# EAGLE design PortableShower (EAGLE 9.4.2)
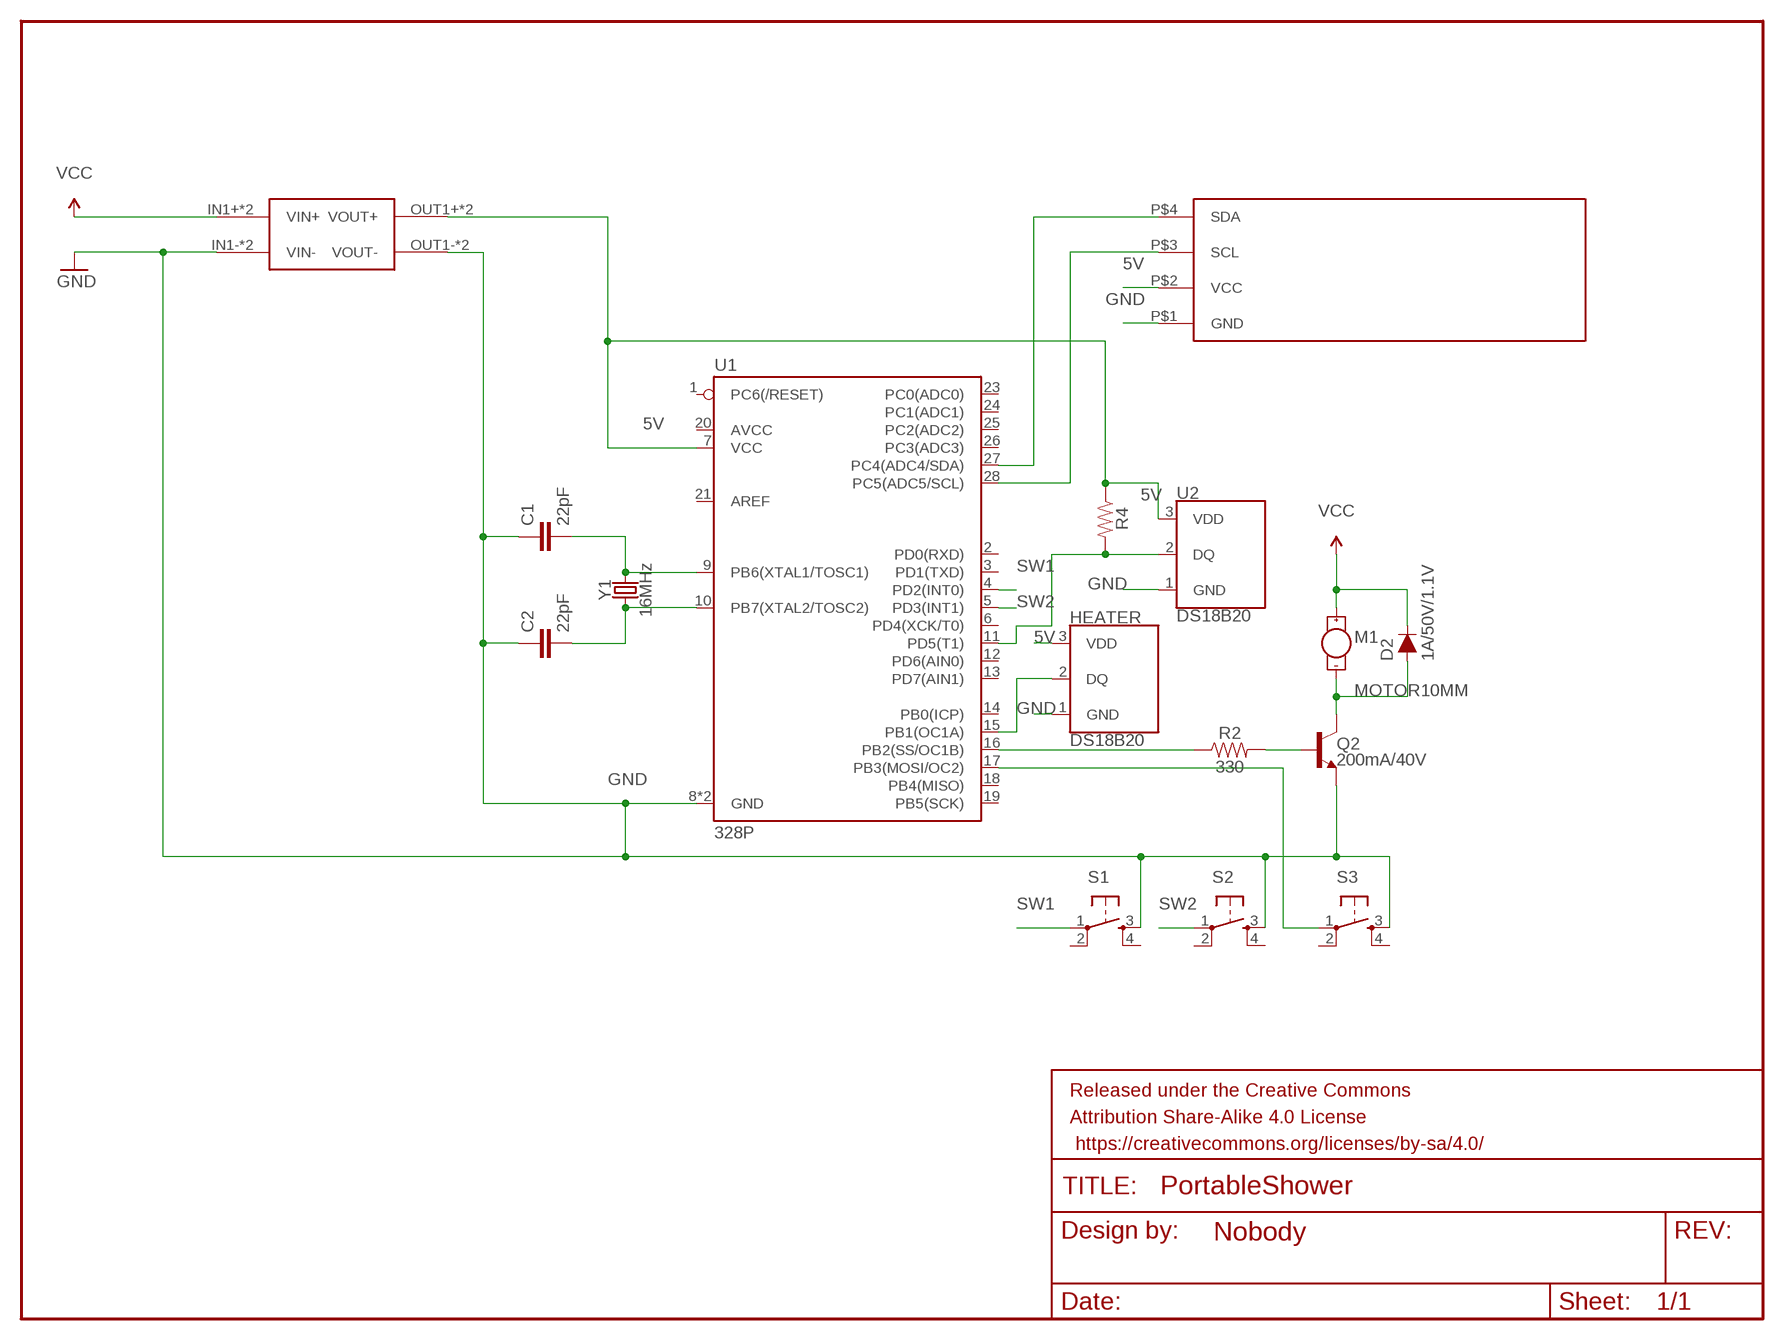
[diagram p0: schematic, sheet 1]

## Parts
C1  22pF  22PF-PTH-2.54MM-200V-5%  [CAP-PTH-2.54]
C2  22pF  22PF-PTH-2.54MM-200V-5%  [CAP-PTH-2.54]
D2  1A/50V/1.1V  DIODE-PTH  [DIODE-1N4001]
FRAME1  FRAME-LETTERNO_PACKAGE  [DUMMY]
HEATER  DS18B20  [TO-92-AMMO]
M1  MOTOR10MM  [VIBE-MOTOR-10MM]
OLED  OLED  [SIP]
Q2  200mA/40V  TRANS_NPN-2N3904  [TO-92]
R2  330  330OHM-HORIZ-1/10W-5%  [AXIAL-0.3]
R4  RESISTORAXIAL-0.3  [AXIAL-0.3]
S1  TAC_SWITCHPTH  [TACTILE-PTH]
S2  TAC_SWITCHPTH  [TACTILE-PTH]
S3  TAC_SWITCHPTH  [TACTILE-PTH]
U1  328P  ATMEGA328P_PDIP  [DIP28]
U2  DS18B20  [TO-92-AMMO]
U$1  MP1584  [DC-BRICK]
Y1  16MHz  CRYSTAL-16MHZPTH-HC49US  [HC49US]

## Nets
5V: HEATER.3(VDD) OLED.P$2(VCC) R4.P$1 U1.7(VCC) U2.3(VDD) U$1.OUT1+(VOUT+) U$1.OUT2+(VOUT+)
GND: C1.1 C2.1 HEATER.1(GND) OLED.P$1(GND) Q2.1(E) S1.3 S2.3 S3.3 U1.8(GND) U1.22(GND) U2.1(GND) U$1.IN1-(VIN-) U$1.IN2-(VIN-) U$1.OUT1-(VOUT-) U$1.OUT2-(VOUT-)
N$1: C1.2 U1.9(PB6(XTAL1/TOSC1)) Y1.2
N$2: C2.2 U1.10(PB7(XTAL2/TOSC2)) Y1.1
N$3: OLED.P$4(SDA) U1.27(PC4(ADC4/SDA))
N$4: OLED.P$3(SCL) U1.28(PC5(ADC5/SCL))
N$6: R2.P$1 U1.16(PB2(SS/OC1B))
N$7: Q2.2(B) R2.P$2
N$8: D2.A M1.- Q2.3(C)
N$9: R4.P$2 U1.11(PD5(T1)) U2.2(DQ)
N$11: HEATER.2(DQ) U1.15(PB1(OC1A))
N$15: S3.1 U1.17(PB3(MOSI/OC2))
SW1: S1.1 U1.4(PD2(INT0))
SW2: S2.1 U1.5(PD3(INT1))
VCC: D2.C M1.+ U$1.IN1+(VIN+) U$1.IN2+(VIN+)
Unconnected: S1.2 S1.4 S2.2 S2.4 S3.2 S3.4 U1.1(PC6(/RESET)) U1.2(PD0(RXD)) U1.3(PD1(TXD)) U1.6(PD4(XCK/T0)) U1.12(PD6(AIN0)) U1.13(PD7(AIN1)) U1.14(PB0(ICP)) U1.18(PB4(MISO)) U1.19(PB5(SCK)) U1.20(AVCC) U1.21(AREF) U1.23(PC0(ADC0)) U1.24(PC1(ADC1)) U1.25(PC2(ADC2)) U1.26(PC3(ADC3))

## Library data of the parts
C1 C2 = SparkFun-Capacitors:22PF: 22pF ceramic capacitors A capacitor is a passive two-terminal electrical component used to store electrical energy temporarily in an electric field.; PROD_ID: CAP-09128
D2 = SparkFun-DiscreteSemi:DIODE: Diode These are standard reverse protection diodes and small signal diodes. SparkFun Products: SparkFun SparkPunk Sound Kit <https://www.sparkfun.com/products/11177> SparkFun ESP8266 Thing <https://www.sparkfun.com/products/13231>; PROD_ID: DIO-09176
FRAME1 = SparkFun-Aesthetics:FRAME-LETTER: Schematic Frame - Letter Standard 8.5x11 US Letter frame; DESIGNER: Nobody; VERSION: v01
HEATER U2 = SparkFun-Sensors:DS18B20: Dallas/Maxim DS18B20 1-Wire Temperature Sensor The DS18B20 reports degrees C with 9 to 12-bit precision, -55C to 125C (+/-0.5C). Each sensor has a unique 64-Bit Serial number etched into it - allows for a huge number of sensors to be used on one data bus. Datasheet <http://datasheets.maximintegrated.com/en/ds/DS18B20.pdf> SparkFun Products One Wire Digital Temperature Sensor - DS18B20 <https://www.sparkfun.com/products/245> (SEN-00245); STORE_ID: SEN-00245
M1 = SparkFun-Electromechanical:MOTOR: Motor (Single-Phase) Two-terminal, single-phase motors. SparkFun Products Vibration Motor <https://www.sparkfun.com/products/8449> (ROB-08449) Physical dimension and wire connections for this powerful vibration motor. Motor has a self adhesive backing.; PROD_ID: COMP-08572; SF_SKU: ROB-08449
OLED = OLED:OLED: I2C 0.91"128x32 OLED
Q2 = SparkFun-DiscreteSemi:TRANS_NPN: NPN transistor Current controlled devices typically used to amplify current or used as a switch. BC547 - COM-08928 <http://www.sparkfun.com/products/8928> (TO-92 45V 100mA) (1.Collector 2.Base 3.Emitter) 2N3904 - COM-00521 <http://www.sparkfun.com/products/521> (TO-92 40V 200mA) (1.Emitter 2.Base 3.Collector) P2N2222A - COM-12852 <http://www.sparkfun.com/products/12852> (TO-92 40V 600mA) (1.Collector 2.Base 3.Emitter); PROD_ID: TRANS-08447
R2 = SparkFun-Resistors:330OHM: 330Ω resistor A resistor is a passive two-terminal electrical component that implements electrical resistance as a circuit element. Resistors act to reduce current flow, and, at the same time, act to lower voltage levels within circuits. - Wikipedia; PROD_ID: RES-8371
R4 = SparkFun-Resistors:RESISTOR: Generic Resistor Package
S1-S3 = SparkFun-Retired:TAC_SWITCH: Momentary Switch Button commonly used for reset or general input. Spark Fun Electronics SKU : COM-00097 SMT- SWCH-08247
U1 = SparkFun-IC-Microcontroller:ATMEGA328P_PDIP: Atmel 328P Through hole ATMEGA328P uC used in the Arduino 32kb flash, 1k EEPROM, 2k SRAM Datasheet <http://www.sparkfun.com/datasheets/Components/SMD/ATMega328.pdf> SparkFun Products Storefront component: AVR 28 Pin 20MHz 32K 6A/D - ATMega328P <https://www.sparkfun.com/products/9061> (COM-09061) SparkFun Simon Says - Through-Hole Soldering Kit <https://www.sparkfun.com/products/10547> (KIT-10547) SparkFun Learn to Solder - Simon Says <https://www.sparkfun.com/products/13708> (KIT-13708) SparkFun BigTime Watch Kit <https://www.sparkfun.com/products/11734> (KIT-11734) SparkFun ClockIt <https://www.sparkfun.com/products/10930> (KIT-10930) SparkFun Serial Enabled LCD Kit <https://www.sparkfun.com/products/10097> (LCD-10097) SparkFun Simon Tilts - Through Hole Soldering Kit <https://www.sparkfun.com/products/12634> (KIT-12634) SparkFun Frequency Counter Kit <https://www.sparkfun.com/products/10140> (KIT-10140) FabFM Radio Kit <https://www.sparkfun.com/products/11043> (KIT-11043) SparkFun Binary Blaster Kit <https://www.sparkfun.com/products/12037> (KIT-12037) SparkFun Metro-Gnome <https://www.sparkfun.com/products/9236> (KIT-09236) ATmega328 with Arduino Optiboot (Uno) <https://www.sparkfun.com/products/10524> (DEV-10524); PROD_ID: IC-09136
U$1 = MP1584-dc-brick:MP1584: MP1584-dc-brick-pcb Step down Input: 4.5V - 28V Ouput 0.8V - 25V max. 3A Cheap on ebay
Y1 = SparkFun-Clocks:CRYSTAL-16MHZ: 16MHz Crystal Digikey Example <http://www.digikey.com/product-search/en?keywords=535-9122-1-ND> Frequency: 16MHz Frequency Stability: ±50ppm Frequency Tolerance: ±20ppm Load Capacitance: 18pF SparkFun Products: Pro Micro -5V/16MHz <https://www.sparkfun.com/products/12640> SparkFun Serial Enabled LCD Kit <https://www.sparkfun.com/products/10097>; PROD_ID: XTAL-08181; SF_ID: COM-00536

## Board
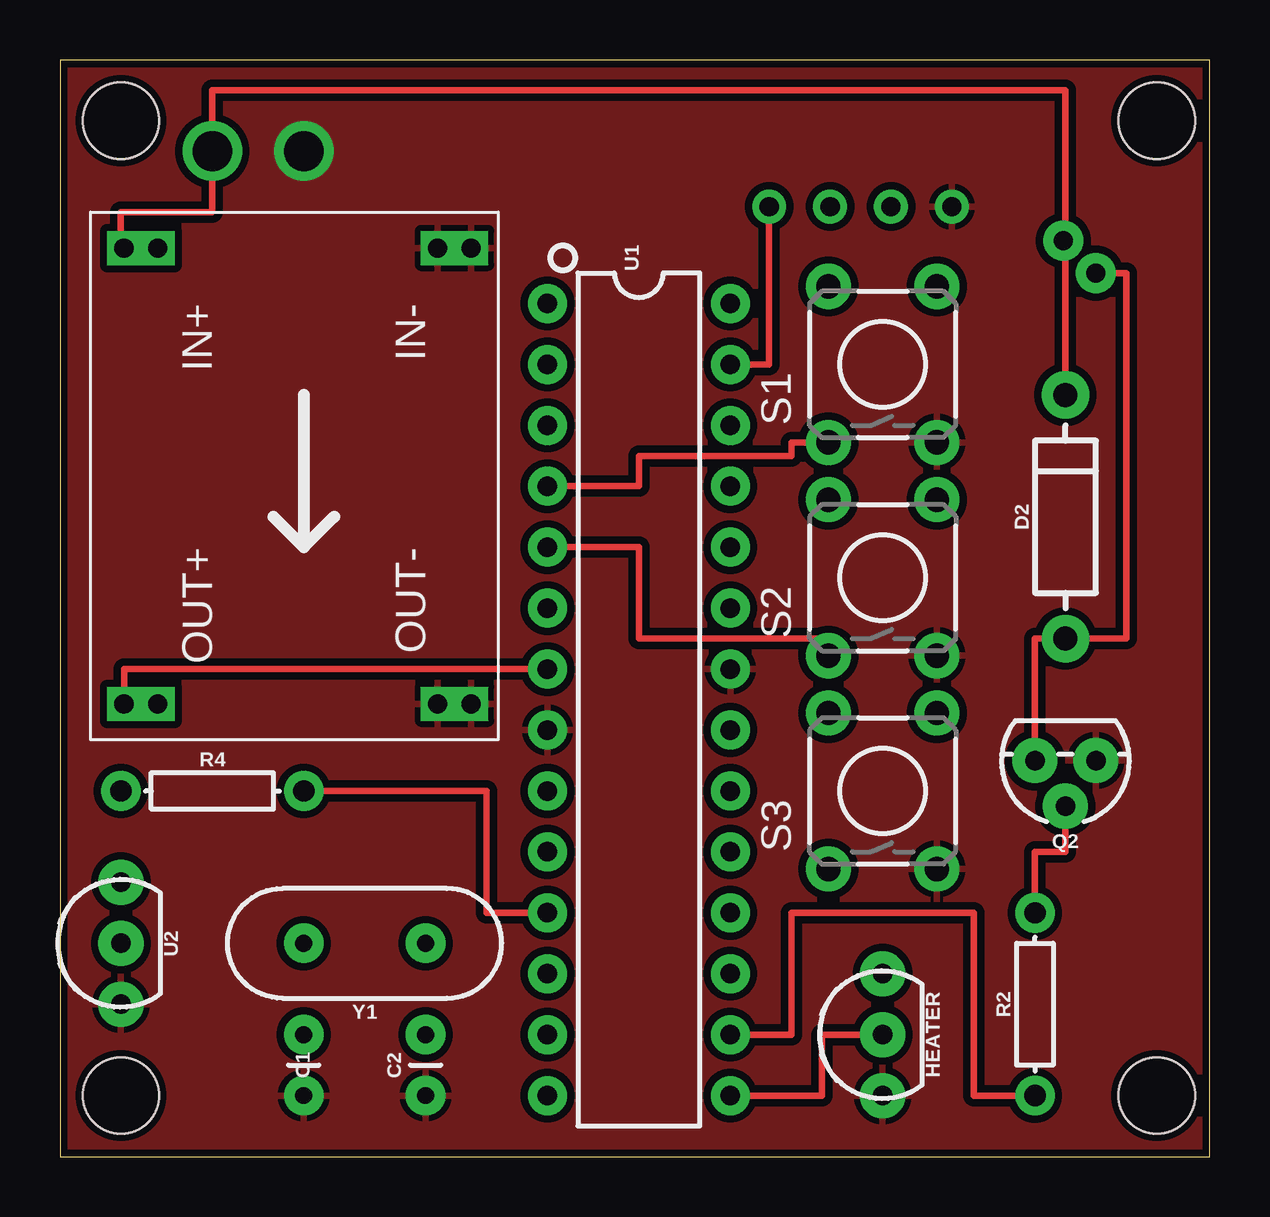
[diagram p1: board, top side]
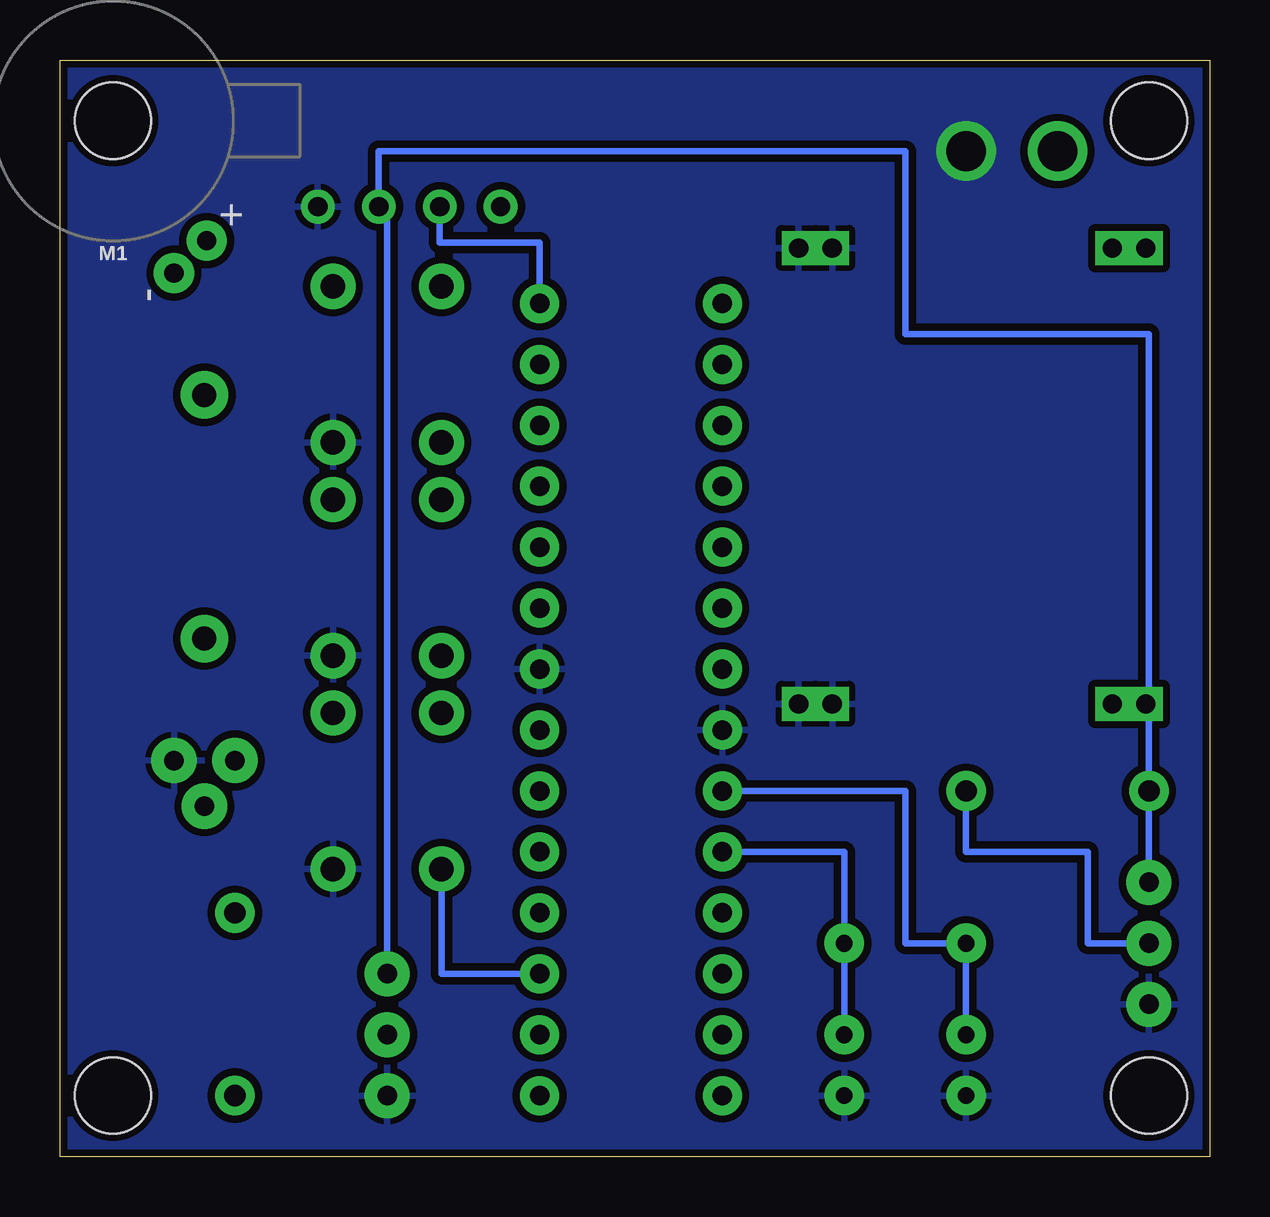
[diagram p2: board, bottom side, seen from below]

Size 47.93 x 45.71 mm. Coordinates in mm from the lower left corner, seen from the top.
Outline: 0,0 47.93,0 47.93,45.71 0,45.71 0,0
Copper layers (1*16): Top 0.035mm / dielectric 1.5mm / Bottom 0.035mm
Design rules "SparkFun": minimum track width 8mil, minimum drill 20mil, track to track 8mil, track to pad 8mil, pad to pad 8mil, via to via 8mil, smd to smd 8mil, copper to edge 8mil, drill to drill 8mil, minimum pad ring 12mil, minimum via ring 10mil, stop-mask expansion 4mil, vias tented up to drill 20mil, thermal gap 10mil
Holes 3.17 mm at 2.54,43.18 2.54,2.54 45.72,43.18 45.72,2.54

### Footprints (pad centres in the part's own frame; a part is rotated, then mirrored left to right if it is on the bottom)
CAP-PTH-2.54 = drill 0.7 pad 1.651: 1 -1.27,0; 2 1.27,0
DIODE-1N4001 = drill 1 pad 1.981: A -5.08,0; C 5.08,0
TO-92-AMMO = drill 0.813 pad 1.88: 1 -2.54,0; 2 0,0; 3 2.54,0
VIBE-MOTOR-10MM = drill 0.8 pad 1.676: + -5,-3.9; - -6.35,-2.54
SIP = drill 0.8: P$1 -17.55,-4.16; P$2 -17.55,-1.62; P$3 -17.55,0.92; P$4 -17.55,3.46
TO-92 = drill 0.813 pad 1.88: 1 -1.27,0; 2 0,1.905; 3 1.27,0
AXIAL-0.3 = drill 0.889 pad 1.651: P$1 -3.81,0; P$2 3.81,0
TACTILE-PTH = drill 1.016 pad 1.88: 1 -3.251,2.261; 2 3.251,2.261; 3 -3.251,-2.261; 4 3.251,-2.261
DIP28 = drill 0.813 pad 1.626: 1 -16.51,-3.81; 2 -13.97,-3.81; 3 -11.43,-3.81; 4 -8.89,-3.81; 5 -6.35,-3.81; 6 -3.81,-3.81; 7 -1.27,-3.81; 8 1.27,-3.81; 9 3.81,-3.81; 10 6.35,-3.81; 11 8.89,-3.81; 12 11.43,-3.81; 13 13.97,-3.81; 14 16.51,-3.81; 15 16.51,3.81; 16 13.97,3.81; 17 11.43,3.81; 18 8.89,3.81; 19 6.35,3.81; 20 3.81,3.81; 21 1.27,3.81; 22 -1.27,3.81; 23 -3.81,3.81; 24 -6.35,3.81; 25 -8.89,3.81; 26 -11.43,3.81; 27 -13.97,3.81; 28 -16.51,3.81
DC-BRICK = drill 0.8 square: IN1+ 1.5,1.4; IN1- 1.5,14.47; IN2+ 1.5,2.8; IN2- 1.5,15.87; OUT1+ 20.5,1.4; OUT1- 20.5,14.47; OUT2+ 20.5,2.8; OUT2- 20.5,15.87
HC49US = drill 0.7 pad 1.651: 1 -2.54,0; 2 2.54,0

### Placement (x,y rotation side)
C1  10.16,3.81 90 top
C2  15.24,3.81 90 top
D2  41.91,26.67 90 top
FRAME1  -44.45,62.23 0 top  (outside the outline)
HEATER  34.29,5.08 90 top
M1  45.72,43.18 90 bottom
OLED  33.02,57.15 90 top
Q2  41.91,16.51 180 top
R2  40.64,6.35 90 top
R4  6.35,15.24 0 top
S1  34.29,33.02 90 top
S2  34.29,24.13 90 top
S3  34.29,15.24 90 top
U1  24.13,19.05 270 top
U2  2.54,8.89 90 top
U$1  1.27,39.37 270 top
Y1  12.7,8.89 180 top

### Tracks (layer width: path | path; a pad name or v marks a point on that pad's centre or on a via)
5V
  Top 0.279: U1.7 2.67,20.32 U$1.OUT1+ U$1.OUT2+
  Bottom 0.279: HEATER.3 34.29,39.6 OLED.P$2 34.64,41.91 12.7,41.91 12.7,34.29 2.54,34.29 2.54,18.87 | U$1.OUT1+ 2.54,18.87 | 2.54,18.87 R4.P$1 U2.3
GND  (via drill 1.65)
  other vias: 10.16,41.91
  pour Top (isolate 0.305): 0,0 0,45.72 48.26,45.72 48.26,0
  pour Bottom (isolate 0.305): 0,0 0,45.72 48.26,45.72 48.26,0
N$1
  Bottom 0.279: U1.9 12.7,15.24 12.7,8.89 Y1.2 C1.2
N$2
  Bottom 0.279: U1.10 15.24,12.7 Y1.1 C2.2
N$3
  Top 0.279: OLED.P$4 29.56,33.02 U1.27
N$4
  Bottom 0.279: OLED.P$3 32.1,38.1 27.94,38.1 U1.28
N$6
  Top 0.279: R2.P$1 38.1,2.54 38.1,10.16 30.48,10.16 30.48,5.08 U1.16
N$7
  Top 0.279: Q2.2 41.91,12.7 40.64,12.7 R2.P$2
N$8
  Top 0.279: M1.- 44.45,36.83 44.45,21.59 D2.A 40.64,21.59 Q2.3
N$9
  Top 0.279: R4.P$2 17.78,15.24 17.78,10.16 U1.11
  Bottom 0.279: U2.2 5.08,8.89 5.08,12.7 10.16,12.7 R4.P$2
N$11
  Top 0.279: U1.15 31.75,2.54 31.75,5.08 HEATER.2
N$15
  Bottom 0.279: S3.1 32.03,7.62 U1.17
SW1
  Top 0.279: S1.1 30.48,29.77 30.48,29.21 24.13,29.21 24.13,27.94 U1.4
SW2
  Top 0.279: S2.1 32.03,21.59 24.13,21.59 24.13,25.4 U1.5
VCC  (via drill 1.65)
  Top 0.279: M1.+ 41.91,38.18 | 41.91,38.18 D2.C | 41.91,38.18 41.91,44.45 6.35,44.45 v6.35,41.91 6.35,39.37 2.54,39.37 2.54,37.87 U$1.IN1+ U$1.IN2+